# Altium schematic sheet main.SchDoc
size A3; Organization: Medical Technologies CZ a.s.; SheetNumber: 1; SheetTotal: 2; Version1: N/A; Version2: N/A; Version3: N/A; Change1description: N/A; Change2description: N/A; Change3description: N/A; Change1DrawnBy: N/A; Change2DrawnBy: N/A; Change3DrawnBy: N/A; Change1CheckedBy: N/A; Change2CheckedBy: N/A; Change3CheckedBy: N/A; PreviusVersion_Chng1: N/A; PreviusVersion_Chng2: N/A; PreviusVersion_Chng3: N/A; Variant1description: Standard assembly; Variant2description: N/A; Variant3description: N/A; Variant4description: N/A; PrimaryCard1: XXXxxxXXX; PrimaryCard2: N/A; PrimaryCard3: N/A; PrimaryCard4: N/A; DocumentName: Docname
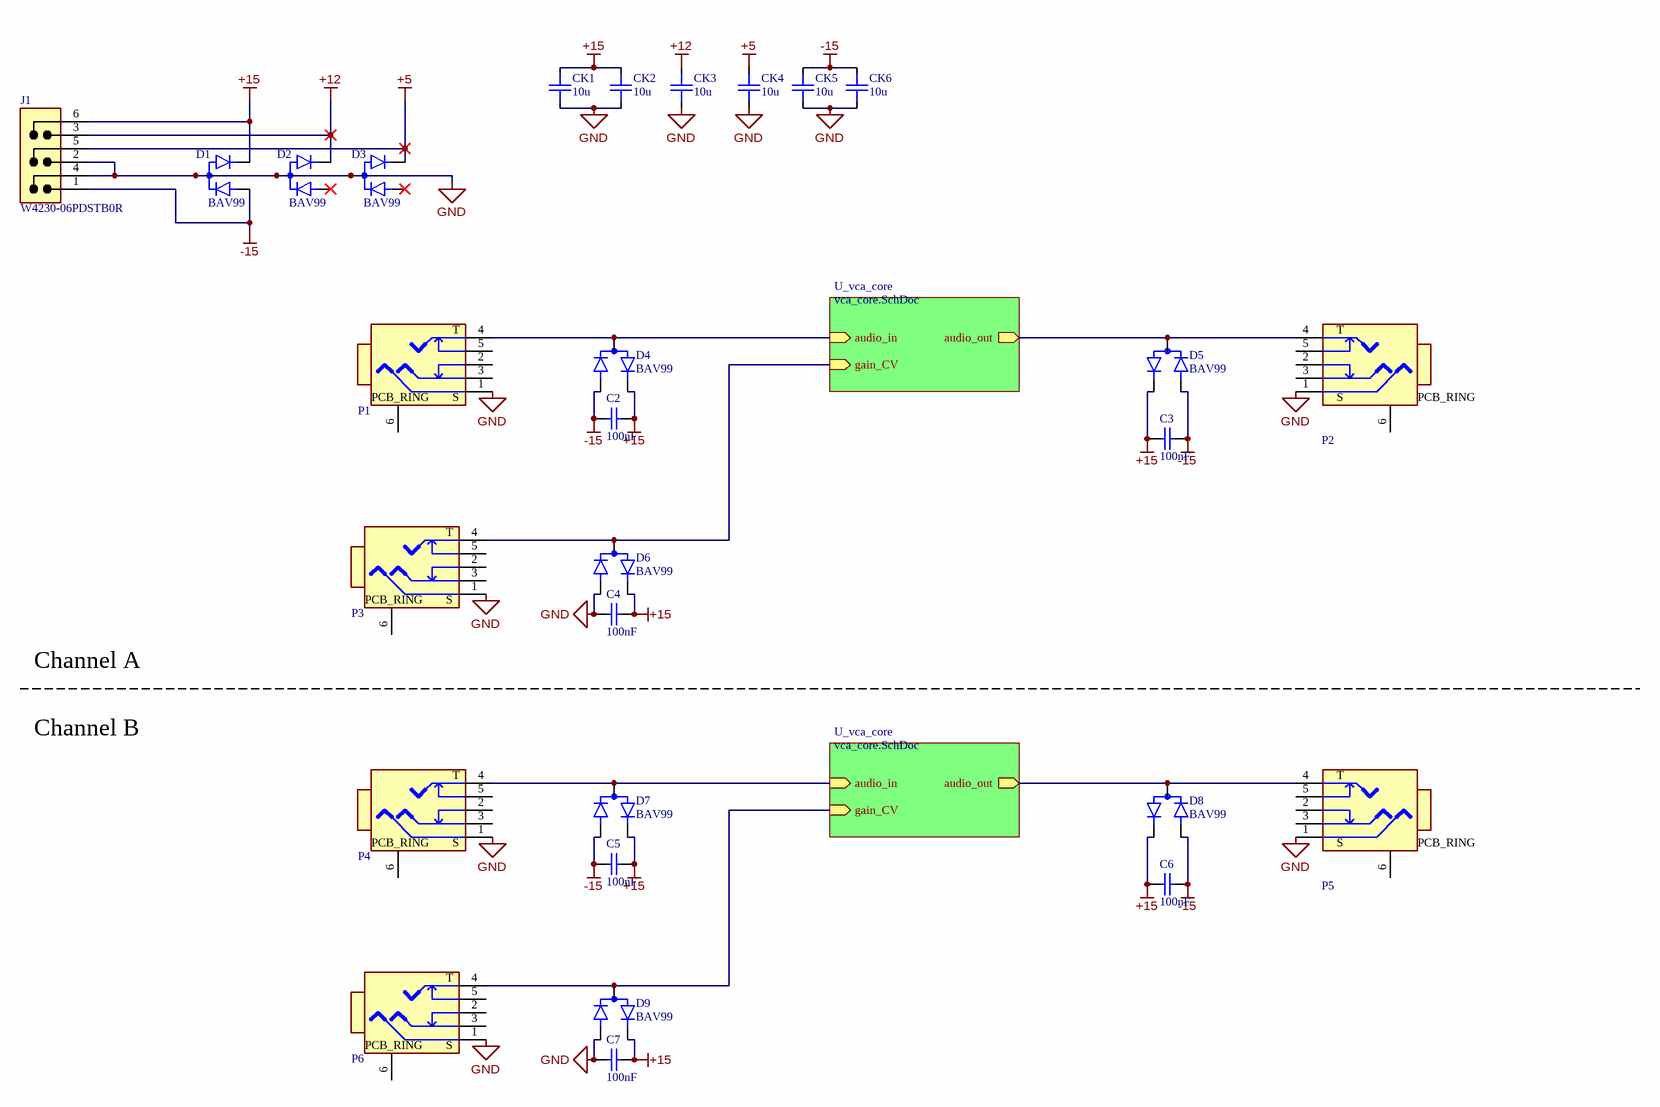
[diagram p0: main.SchDoc]

## Parts
C2  100nF  [WCAP-CSGP_0603_L1.6W0.8H0.8_Reflow]
C3  100nF  [WCAP-CSGP_0603_L1.6W0.8H0.8_Reflow]
C4  100nF  [WCAP-CSGP_0603_L1.6W0.8H0.8_Reflow]
C5  100nF  [WCAP-CSGP_0603_L1.6W0.8H0.8_Reflow]
C6  100nF  [WCAP-CSGP_0603_L1.6W0.8H0.8_Reflow]
C7  100nF  [WCAP-CSGP_0603_L1.6W0.8H0.8_Reflow]
CK1  10u  [CAPC3225X27N(SMC1210)]
CK2  10u  [CAPC3225X27N(SMC1210)]
CK3  10u  [CAPC3225X27N(SMC1210)]
CK4  10u  [CAPC3225X27N(SMC1210)]
CK5  10u  [CAPC3225X27N(SMC1210)]
CK6  10u  [CAPC3225X27N(SMC1210)]
D1  BAV99  [SOT95P230X110-3N(SOT23)]
D2  BAV99  [SOT95P230X110-3N(SOT23)]
D3  BAV99  [SOT95P230X110-3N(SOT23)]
D4  BAV99  [SOT95P230X110-3N(SOT23)]
D5  BAV99  [SOT95P230X110-3N(SOT23)]
D6  BAV99  [SOT95P230X110-3N(SOT23)]
D7  BAV99  [SOT95P230X110-3N(SOT23)]
D8  BAV99  [SOT95P230X110-3N(SOT23)]
D9  BAV99  [SOT95P230X110-3N(SOT23)]
J1  W4230-06PDSTB0R  [W4230-06PDS]
P1  NYS232  [NYS232]  (value not drawn)
P2  NYS232  [NYS232]  (value not drawn)
P3  NYS232  [NYS232]  (value not drawn)
P4  NYS232  [NYS232]  (value not drawn)
P5  NYS232  [NYS232]  (value not drawn)
P6  NYS232  [NYS232]  (value not drawn)

## Sub-sheets
U_vca_core = vca_core.SchDoc: audio_in (in), gain_CV (in), audio_out (out)
U_vca_core = vca_core.SchDoc: audio_in (in), gain_CV (in), audio_out (out)

## Nets
+5: CK4.1 D3.2(C2) J1.5
+12: CK3.1 D2.2(C2) J1.3
+15: C2.2 C3.2 C4.2 C5.2 C6.2 C7.2 CK1.1 CK2.1 D1.2(C2) D4.2(C2) D5.2(C2) D6.2(C2) D7.2(C2) D8.2(C2) D9.2(C2) J1.6
-15: C2.1 C3.1 C5.1 C6.1 CK5.1 CK6.1 D1.1(A1) D4.1(A1) D5.1(A1) D7.1(A1) D8.1(A1) J1.1
GND: C4.1 C7.1 CK1.2 CK2.2 CK3.2 CK4.2 CK5.2 CK6.2 D1.3(C1A2) D2.3(C1A2) D3.3(C1A2) D6.1(A1) D9.1(A1) J1.2 J1.4 P1.1(S) P2.1(S) P3.1(S) P4.1(S) P5.1(S) P6.1(S)
NetD4_3: D4.3(C1A2) P1.4(TN) ; sheet U_vca_core/audio_in
NetD5_3: D5.3(C1A2) P2.4(TN) ; sheet U_vca_core/audio_out
NetD6_3: D6.3(C1A2) P3.4(TN) ; sheet U_vca_core/gain_CV
NetD7_3: D7.3(C1A2) P4.4(TN) ; sheet U_vca_core/audio_in
NetD8_3: D8.3(C1A2) P5.4(TN) ; sheet U_vca_core/audio_out
NetD9_3: D9.3(C1A2) P6.4(TN) ; sheet U_vca_core/gain_CV

Not connected (* = marked no-connect by the designer): D2 1(A1)*; D3 1(A1)*; P1 2(RN) 3(R) 5(T) 6(PCB_RING); P2 2(RN) 3(R) 5(T) 6(PCB_RING); P3 2(RN) 3(R) 5(T) 6(PCB_RING); P4 2(RN) 3(R) 5(T) 6(PCB_RING); P5 2(RN) 3(R) 5(T) 6(PCB_RING); P6 2(RN) 3(R) 5(T) 6(PCB_RING)

## Notes on the sheet
- Channel A
- Channel B
- Číslo výkresu /drawing number/:
- Nazev listu/sheet name/:
- DPS projekt/PCB project/:
- Kreslil /drawn by/ :
- Kontroloval /checked by/:
- Datum /date/:
- List /sheet/:
- /
- (in symbol NYS232) PCB_RING

## Library data of the parts
C2-C7 = 885012206095: WCAP-CSGP Multilayer Ceramic Chip Capacitor, General Purpose, size 0603, X7R, 100nF, 50V; Manufacturer: Wurth Elektronik; Capacitance Tolerance: +/-10%; Dissipation Factor: 3%; Isolation Resistance: 5GOhm; Technical Reference: X7R0603104K050DFCT10000; Capacitance: 100nF; Ceramic Type: X7R; ComponentLink1Description: Manufacturer Link; ComponentLink1URL: http://www.we-online.de; ComponentLink2Description: Datasheet; ComponentLink2URL: https://www.we-online.com/catalog/datasheet/885012206095.pdf; Height: 0.8mm; Length: 1.6mm; Manufacturer Part Number: 885012206095; Mounting Technology: SMT; Operating Temperature max.: 125C; Operating Temperature min.: -55C; Packaging: Tape and Reel; Rated Voltage: 50V; Size: 0603; Width: 0.8mm
CK1-CK6 = ECK+10U50VXX0: C; 10u; 50V; 10%; X7R; ??;; Manufacturer: Murata: GRM32ER71H106KA12L;;Samsung Electro-mechanics: CL32B106KBJNNNE; Note: X7R, 9uF @ 10V, 5uF @ 30V, 2.5uF @ 50V; Component_Class: Capacitor; Status_I: Production; Status_II: Active; Tolerance_Pct: 10; Voltage_Rating_V: 50; Capacitance_F: 1E-5; KK: ECK+10U50VXX0; Value: 10u; SMD: 1; ComponentLink2URL: I:\DataSheets\ECK+10U50VXX0_MurataEN100.pdf; ComponentLink2Description: ECK+10U50VXX0_MurataEN100.pdf; ComponentLink3URL: I:\DataSheets\ECK+10U50VXX0_SamsungEN100.pdf; ComponentLink3Description: ECK+10U50VXX0_SamsungEN100.pdf; Dielectric_Type: X7R; ComponentLink1URL: heliosgreen://v1/hegMT/5-MT/Classes(343)/Folders/OpenForm?RecordNumbers=[10658879]; ComponentLink1Description: Helios
J1 = EJ-W4230-06PDSTB0RXX0: Con; Micro Fit 3.0; 6x; PCB; Straight; 250V; 5A; Male; Tin; ??;; Manufacturer: HSUAN MAO: W4230-06PDSTB0R;;HSUAN MAO: W4230-06PDSTB0N;;HSM: W4230-06PDSTB0R;;HSM: W4230-06PDSTB0N; Component_Class: Connector; Status_I: Production; Status_II: Active; Multiplicity: 6; Voltage_Rating_V: 250; Current_Rating_A: 5; KK: EJ-W4230-06PDSTB0RXX0; Value: W4230-06PDSTB0R; SMD: 0; ComponentLink2URL: i:\datasheets\EJ-W4230-XXPDSXB0RXX0_HsuanMao.pdf; ComponentLink2Description: EJ-W4230-XXPDSXB0RXX0_HsuanMao.pdf; ComponentLink3URL: I:\datasheets\EJ-W4230-XXPDSTB0NXX0_HsuanMaoEN100.pdf; ComponentLink3Description: EJ-W4230-XXPDSTB0NXX0_HsuanMaoEN100.pdf; Mounting_Style: PCB; Connector_Family: Micro Fit 3.0; Angle: Straight; Gender: Male; Plating: Tin; ComponentLink1URL: heliosgreen://v1/hegMT/5-MT/Classes(343)/Folders/OpenForm?RecordNumbers=[6765380]; ComponentLink1Description: Helios; System: Connector
P1-P6 = NYS232: 6.3 mm jack, right angle, THT
D1-D9 = BAV99: ComponentLink1Description: New link; ComponentLink1URL: C:\Users\Public\Documents\Altium\DSH\EDD+BAV99XX0_OnsemiEN100.PDF